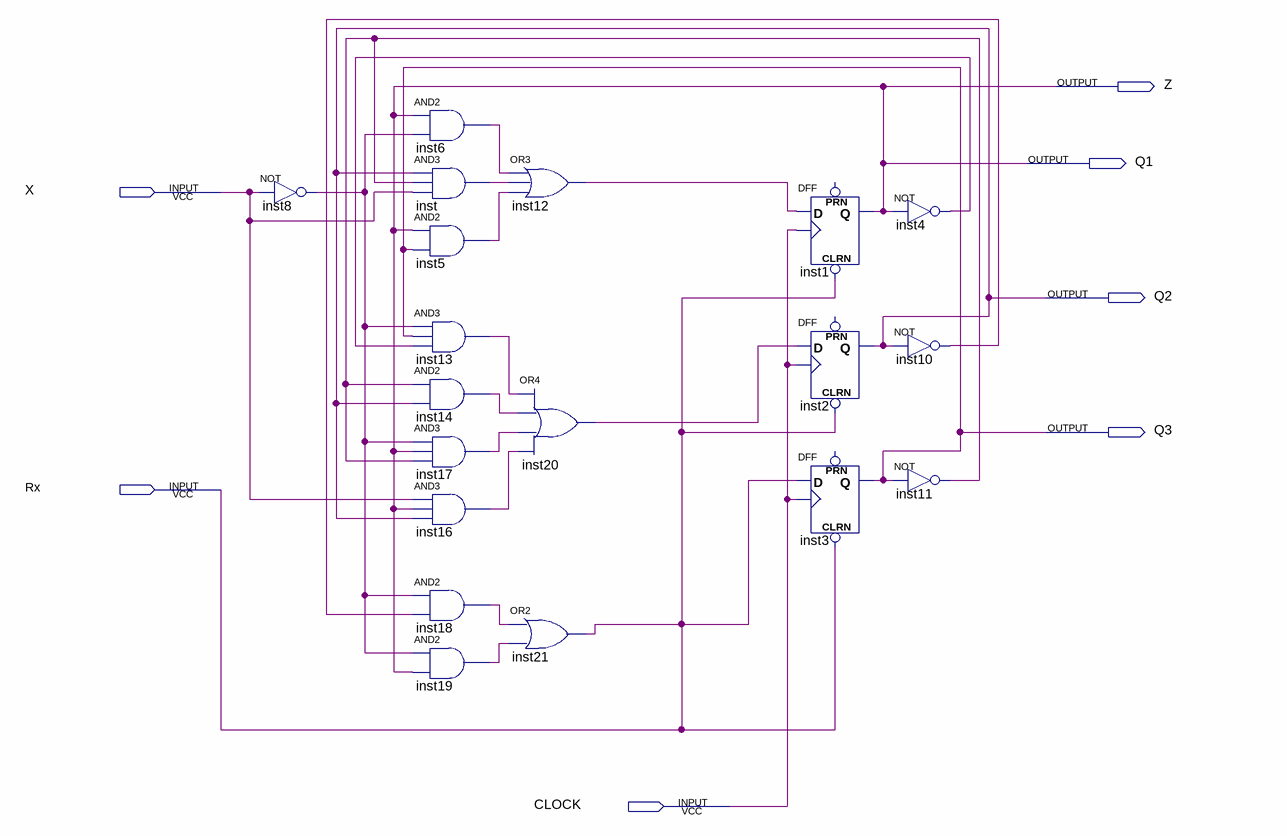
[diagram p0: schematic sheet]
// Quartus schematic Project1.bdf as structural Verilog: 19 symbols, 7 pins
module Project1 (
  input  X,
  input  Rx,
  input  CLOCK,
  output Z,
  output Q1,
  output Q2,
  output Q3
);

  wire inst4_out, inst5_out, inst6_out, inst8_out, inst10_out, inst11_out, inst12_out, inst13_out,
       inst14_out, inst16_out, inst17_out, inst18_out, inst19_out, inst20_out, inst_out;

  not inst8 (inst8_out, X);
  and inst6 (inst6_out, Q1, inst8_out);
  and inst (inst_out, Q2, inst11_out, X);
  and inst5 (inst5_out, Q1, Q3);
  and inst13 (inst13_out, inst8_out, Q3, inst4_out);
  and inst14 (inst14_out, inst11_out, Q2);
  and inst17 (inst17_out, inst8_out, Q1, inst11_out);
  and inst16 (inst16_out, X, Q1, Q2);
  and inst18 (inst18_out, inst8_out, inst10_out);
  and inst19 (inst19_out, inst8_out, Q1);
  or inst12 (inst12_out, inst6_out, inst_out, inst5_out);
  or inst20 (inst20_out, inst13_out, inst14_out, inst17_out, inst16_out);
  or inst21 (Rx, inst18_out, inst19_out);
  DFF inst1 (.CLRN(Rx), .CLK(CLOCK), .D(inst12_out), .Q(Q1));  // open: PRN
  DFF inst2 (.CLRN(Rx), .CLK(CLOCK), .D(inst20_out), .Q(Q2));  // open: PRN
  DFF inst3 (.CLRN(Rx), .CLK(CLOCK), .D(Rx), .Q(Q3));  // open: PRN
  not inst4 (inst4_out, Q1);
  not inst10 (inst10_out, Q2);
  not inst11 (inst11_out, Q3);

  assign Z = Q1;
endmodule
